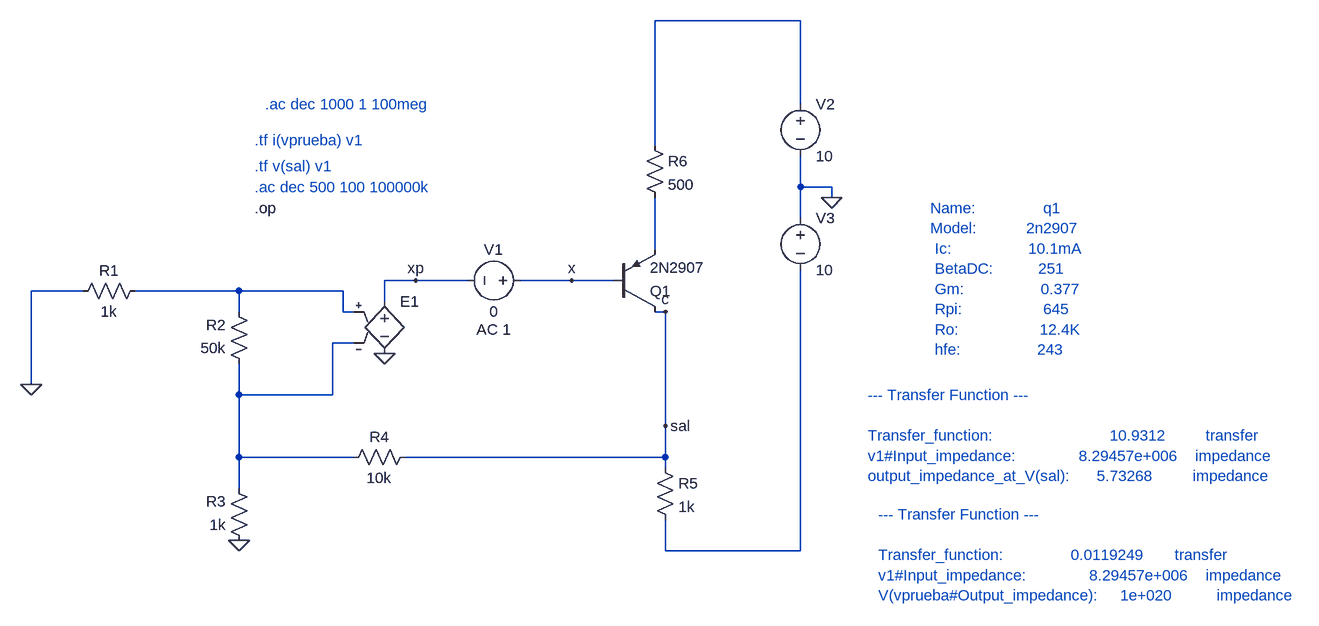
[diagram p0: schematic real_T4x.asc]
real_T4x.asc, the LTspice schematic file:
Version 4
SHEET 1 1704 1092
WIRE 880 -288 656 -288
WIRE 880 -160 880 -288
WIRE 656 -96 656 -288
WIRE 880 -32 880 -80
WIRE 928 -32 880 -32
WIRE 928 -16 928 -32
WIRE 880 16 880 -32
WIRE 656 64 656 -16
WIRE 288 112 240 112
WIRE 368 112 288 112
WIRE 528 112 448 112
WIRE 592 112 528 112
WIRE -224 128 -304 128
WIRE 16 128 -144 128
WIRE 176 128 16 128
WIRE 240 144 240 112
WIRE 16 160 16 128
WIRE 176 160 176 128
WIRE 192 160 176 160
WIRE 672 160 656 160
WIRE 192 208 160 208
WIRE -304 272 -304 128
WIRE 16 288 16 240
WIRE 160 288 160 208
WIRE 160 288 16 288
WIRE 672 336 672 160
WIRE 16 384 16 288
WIRE 192 384 16 384
WIRE 672 384 672 336
WIRE 672 384 272 384
WIRE 672 400 672 384
WIRE 16 432 16 384
WIRE 672 528 672 480
WIRE 880 528 880 96
WIRE 880 528 672 528
FLAG 240 224 0
FLAG -304 272 0
FLAG 16 512 0
FLAG 928 -16 0
FLAG 672 336 sal
FLAG 672 160 c
FLAG 288 112 xp
FLAG 528 112 x
DATAFLAG 112 128 ""
DATAFLAG 112 288 ""
DATAFLAG -288 128 ""
DATAFLAG 656 384 ""
SYMBOL e 240 128 R0
WINDOW 3 24 96 Invisible 2
SYMATTR Value -1000/(1+s/62831.8)
SYMATTR InstName E1
SYMATTR SpiceModel laplace
SYMBOL res -128 112 R90
WINDOW 0 0 56 VBottom 2
WINDOW 3 32 56 VTop 2
SYMATTR InstName R1
SYMATTR Value 1k
SYMBOL res 32 256 R180
WINDOW 0 36 76 Left 2
WINDOW 3 36 40 Left 2
SYMATTR InstName R2
SYMATTR Value 50k
SYMBOL res 32 528 R180
WINDOW 0 36 76 Left 2
WINDOW 3 36 40 Left 2
SYMATTR InstName R3
SYMATTR Value 1k
SYMBOL res 176 400 R270
WINDOW 0 32 56 VTop 2
WINDOW 3 0 56 VBottom 2
SYMATTR InstName R4
SYMATTR Value 10k
SYMBOL res 656 384 R0
SYMATTR InstName R5
SYMATTR Value 1k
SYMBOL pnp 592 160 M180
SYMATTR InstName Q1
SYMATTR Value 2N2907
SYMBOL res 640 -112 R0
SYMATTR InstName R6
SYMATTR Value 500
SYMBOL voltage 880 -176 R0
WINDOW 123 0 0 Left 0
WINDOW 39 0 0 Left 0
SYMATTR InstName V2
SYMATTR Value 10
SYMBOL voltage 880 0 R0
WINDOW 123 0 0 Left 0
WINDOW 39 0 0 Left 0
SYMATTR InstName V3
SYMATTR Value 10
SYMBOL voltage 464 112 R90
WINDOW 0 -32 56 VBottom 2
WINDOW 3 32 56 VTop 2
WINDOW 123 60 56 VTop 2
WINDOW 39 0 0 Left 0
SYMATTR InstName V1
SYMATTR Value 0
SYMATTR Value2 AC 1
TEXT 40 0 Left 2 !.op
TEXT 40 -32 Left 2 ;.ac dec 500 100 100000k
TEXT 1080 0 Left 2 ;Name:               q1\nModel:           2n2907\n Ic:                 10.1mA\n BetaDC:          251\n Gm:                 0.377 \n Rpi:                  645\n Ro:                  12.4K\n hfe:                 243
TEXT 40 -64 Left 2 ;.tf v(sal) v1
TEXT 984 288 Left 2 ;--- Transfer Function ---\n \nTransfer_function:                          10.9312         transfer\nv1#Input_impedance:              8.29457e+006    impedance\noutput_impedance_at_V(sal):      5.73268         impedance
TEXT 40 -104 Left 2 ;.tf i(vprueba) v1
TEXT 1000 472 Left 2 ;--- Transfer Function ---\n \nTransfer_function:               0.0119249       transfer\nv1#Input_impedance:              8.29457e+006    impedance\nV(vprueba#Output_impedance):     1e+020          impedance
TEXT 56 -160 Left 2 ;.ac dec 1000 1 100meg

The netlist it stands for:
* real_T4x.asc
E1 xp 0 N003 N004 laplace -1000/(1+s/62831.8)
R1 N003 0 1k
R2 N004 N003 50k
R3 0 N004 1k
R4 N004 c 10k
R5 c N005 1k
Q1 c x N002 0 2N2907
R6 N001 N002 500
V2 N001 0 10
V3 0 N005 10
V1 x xp 0 AC 1
.model NPN NPN
.model PNP PNP
.lib standard.bjt
.op
* .ac dec 500 100 100000k
* Name:               q1
* Model:           2n2907
*  Ic:                 10.1mA
*  BetaDC:          251
*  Gm:                 0.377
*  Rpi:                  645
*  Ro:                  12.4K
*  hfe:                 243
* .tf v(sal) v1
* --- Transfer Function ---
* Transfer_function:                          10.9312         transfer
* v1#Input_impedance:              8.29457e+006    impedance
* output_impedance_at_V(sal):      5.73268         impedance
* .tf i(vprueba) v1
* --- Transfer Function ---
* Transfer_function:               0.0119249       transfer
* v1#Input_impedance:              8.29457e+006    impedance
* V(vprueba#Output_impedance):     1e+020          impedance
* .ac dec 1000 1 100meg
.backanno
.end